# EAGLE schematic kwatch-v1-rev1 (EAGLE 7.6.0)

## Sheet 1 of 2
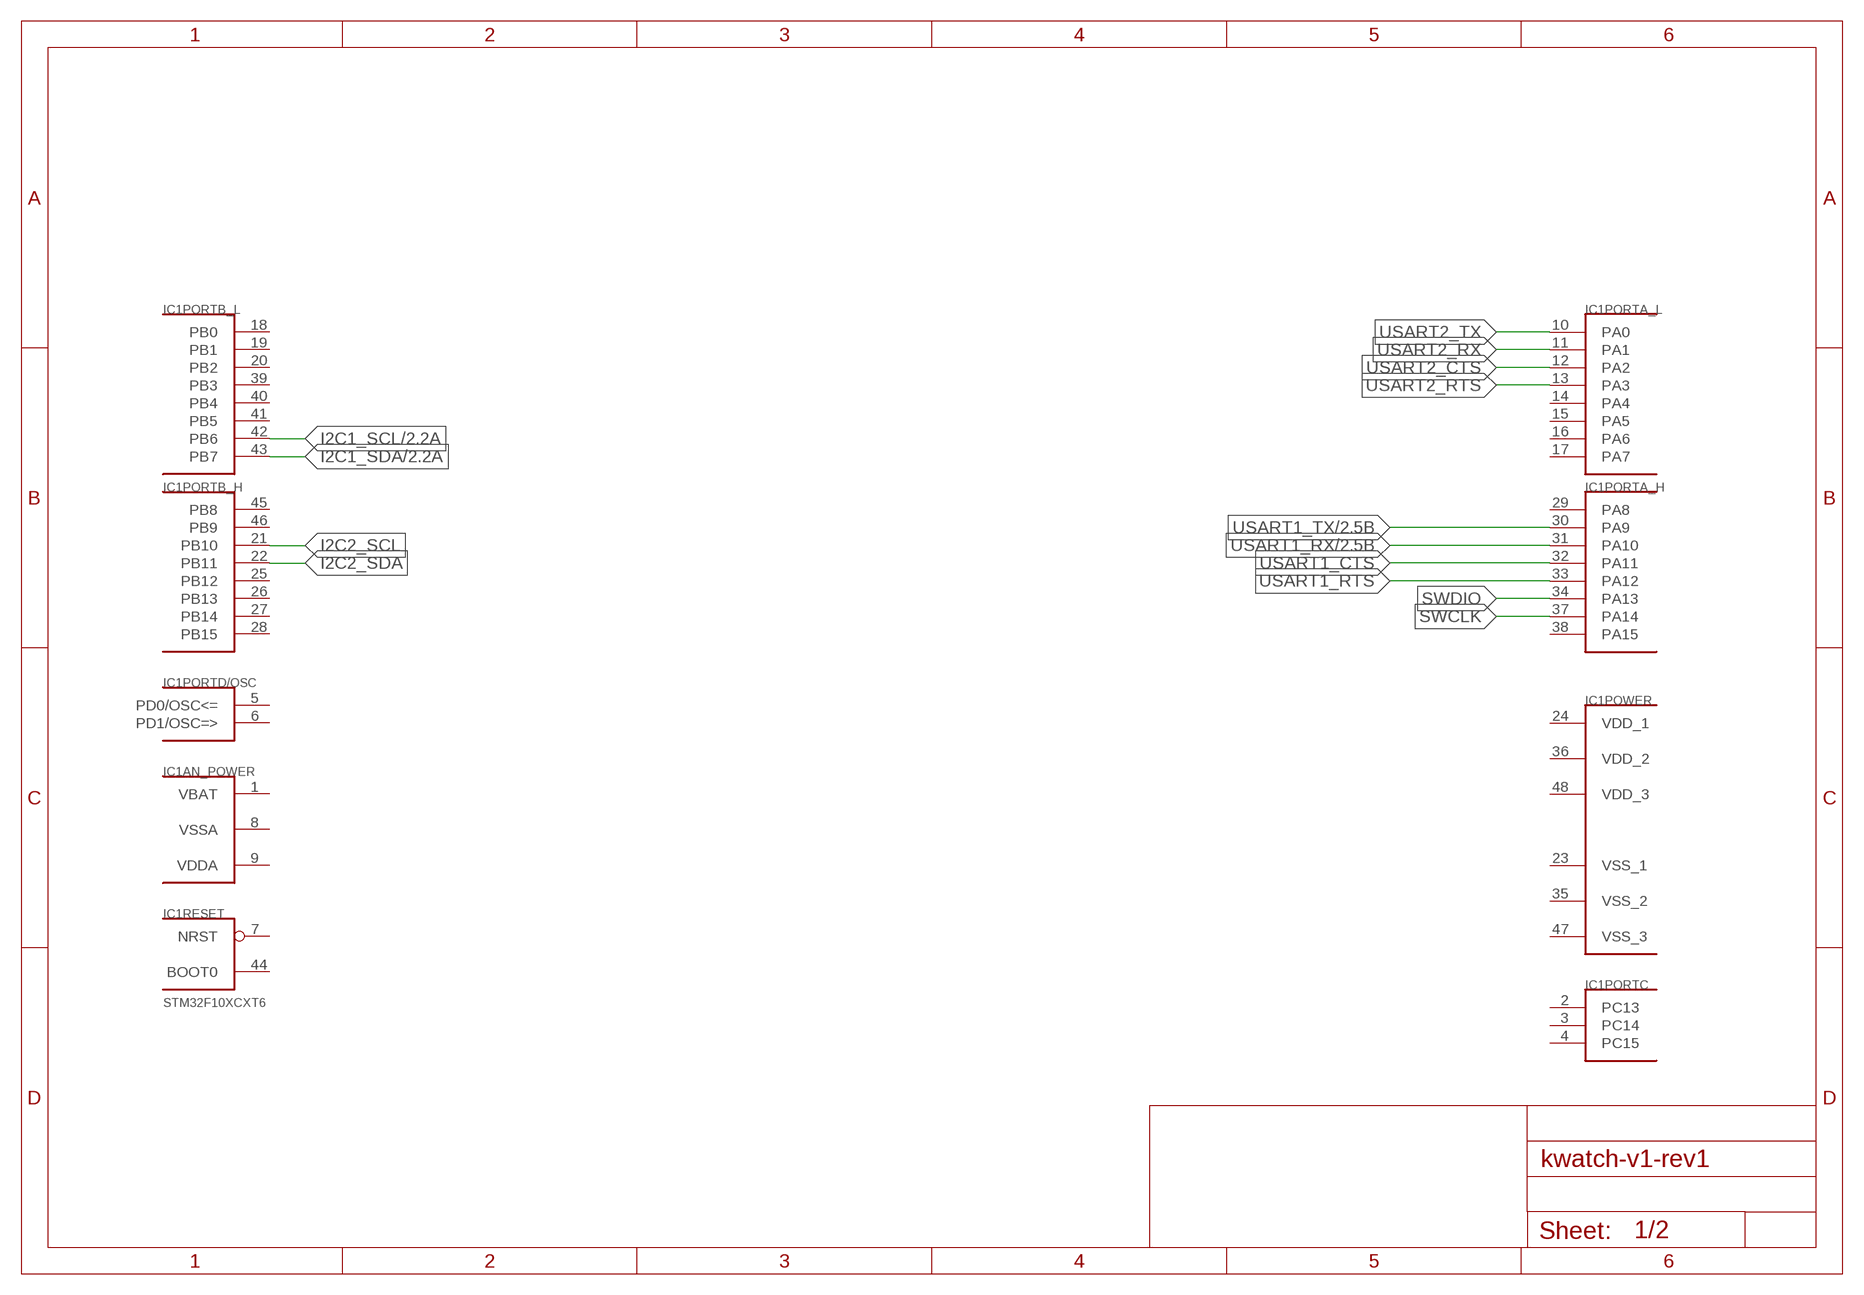
[diagram p0: schematic, sheet 1]

### Parts
IC1  STM32F10XCXT6  [TQFP48]

### Nets
I2C1_SCL: IC1.42(PORTB_L:PB6) ; also sheet 2
I2C1_SDA: IC1.43(PORTB_L:PB7) ; also sheet 2
I2C2_SCL: IC1.21(PORTB_H:PB10)
I2C2_SDA: IC1.22(PORTB_H:PB11)
SWCLK: IC1.37(PORTA_H:PA14)
SWDIO: IC1.34(PORTA_H:PA13)
USART1_CTS: IC1.32(PORTA_H:PA11)
USART1_RTS: IC1.33(PORTA_H:PA12)
USART1_RX: IC1.31(PORTA_H:PA10) ; also sheet 2
USART1_TX: IC1.30(PORTA_H:PA9) ; also sheet 2
USART2_CTS: IC1.12(PORTA_L:PA2)
USART2_RTS: IC1.13(PORTA_L:PA3)
USART2_RX: IC1.11(PORTA_L:PA1)
USART2_TX: IC1.10(PORTA_L:PA0)
Unconnected: IC1.2(PORTC:PC13) IC1.3(PORTC:PC14) IC1.4(PORTC:PC15) IC1.5(PORTD/OSC:PD0/OSC<=) IC1.6(PORTD/OSC:PD1/OSC=>) IC1.7(RESET:NRST) IC1.14(PORTA_L:PA4) IC1.15(PORTA_L:PA5) IC1.16(PORTA_L:PA6) IC1.17(PORTA_L:PA7) IC1.18(PORTB_L:PB0) IC1.19(PORTB_L:PB1) IC1.20(PORTB_L:PB2) IC1.25(PORTB_H:PB12) IC1.26(PORTB_H:PB13) IC1.27(PORTB_H:PB14) IC1.28(PORTB_H:PB15) IC1.29(PORTA_H:PA8) IC1.38(PORTA_H:PA15) IC1.39(PORTB_L:PB3) IC1.40(PORTB_L:PB4) IC1.41(PORTB_L:PB5) IC1.44(RESET:BOOT0) IC1.45(PORTB_H:PB8) IC1.46(PORTB_H:PB9)

## Sheet 2 of 2: Peripherals connection
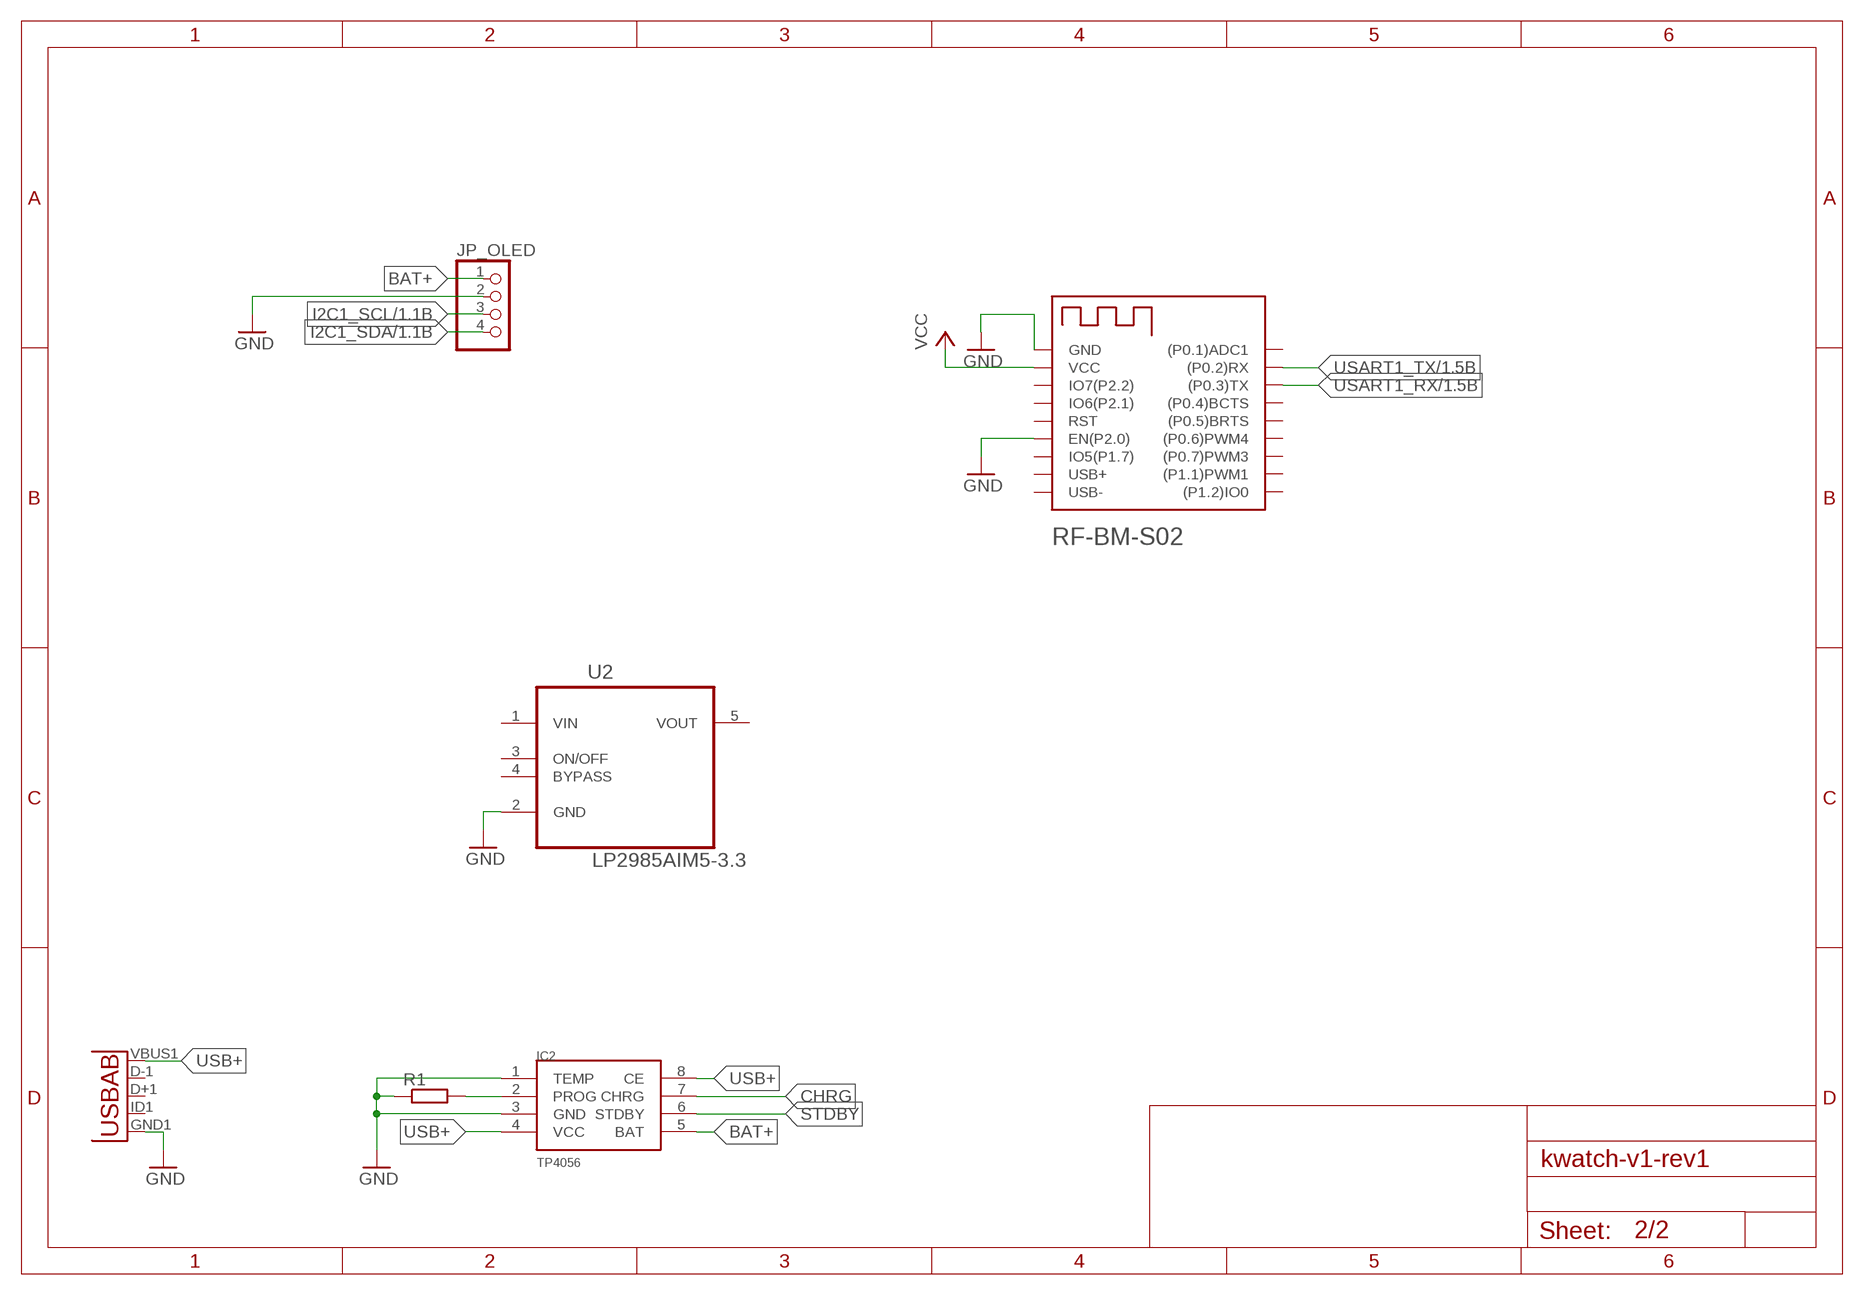
[diagram p1: schematic, sheet 2]

### Parts
BM-S1  RF-BM-S02  [RF-BM-S02]
IC2  TP4056  [SOP-8]
JP_OLED  PINHD-1X04_2.00  [1X04M]
R1  R-EU_R0805  [R0805]
U1  USB""  [USB-MICRO-SMD]
U2  LP2985AIM5-3.3  [SOT95P284X119-5N]

### Nets
BAT+: IC2.5(BAT) JP_OLED.1
CHRG: IC2.7(CHRG)
GND: BM-S1.P$1(GND) BM-S1.P$6(EN(P2.0)) IC2.1(TEMP) IC2.3(GND) JP_OLED.2 R1.1 U1.GND1(GND) U2.2(GND)
I2C1_SCL: JP_OLED.3 ; also sheet 1
I2C1_SDA: JP_OLED.4 ; also sheet 1
N$2: IC2.2(PROG) R1.2
STDBY: IC2.6(STDBY)
USART1_RX: BM-S1.P$16((P0.3)TX) ; also sheet 1
USART1_TX: BM-S1.P$17((P0.2)RX) ; also sheet 1
USB+: IC2.4(VCC) IC2.8(CE) U1.VBUS1(VBUS)
VCC: BM-S1.P$2(VCC)
Unconnected: BM-S1.P$3(IO7(P2.2)) BM-S1.P$4(IO6(P2.1)) BM-S1.P$5(RST) BM-S1.P$7(IO5(P1.7)) BM-S1.P$8(USB+) BM-S1.P$9(USB-) BM-S1.P$10((P1.2)IO0) BM-S1.P$11((P1.1)PWM1) BM-S1.P$12((P0.7)PWM3) BM-S1.P$13((P0.6)PWM4) BM-S1.P$14((P0.5)BRTS) BM-S1.P$15((P0.4)BCTS) BM-S1.P$18((P0.1)ADC1) U1.D+1(D+) U1.D-1(D-) U1.ID1(USBID) U2.3(ON/OFF) U2.4(BYPASS) U2.5(VOUT)

## Power pins joined to a net without a drawn wire
VBAT: IC1.1(AN_POWER:VBAT)
VDD_1: IC1.24(POWER:VDD_1)
VDD_2: IC1.36(POWER:VDD_2)
VDD_3: IC1.48(POWER:VDD_3)
VDDA: IC1.9(AN_POWER:VDDA)
VIN: U2.1(VIN)
VSS_1: IC1.23(POWER:VSS_1)
VSS_2: IC1.35(POWER:VSS_2)
VSS_3: IC1.47(POWER:VSS_3)
VSSA: IC1.8(AN_POWER:VSSA)

## Library data of the parts
BM-S1 = szrfstar:RF-BM-S02: szrfstar.com
IC1 = stm32:STM32F10XCXT6: ST STM32F101/103 48pin LQFP
IC2 = TP4056:TP4056
JP_OLED = pinhead-2:PINHD-1X04: PIN HEADER
R1 = resistor:R-EU_: RESISTOR, European symbol
U1 = MicroUSB:USB: This is a USB AB connector that is compatible with USB OTG. i.e. this connector can serve as a host or device
U2 = LP2985AIM5X-3.3:LP2985AIM5-3.3: Low-Dropout Regulator; MPN: LP2985AIM5-3.3; OC_FARNELL: 9778276; OC_NEWARK: 97K3686; PACKAGE: SOT23-5; SUPPLIER: National Semiconductor